# Altium schematic sheet M2.SchDoc
size A
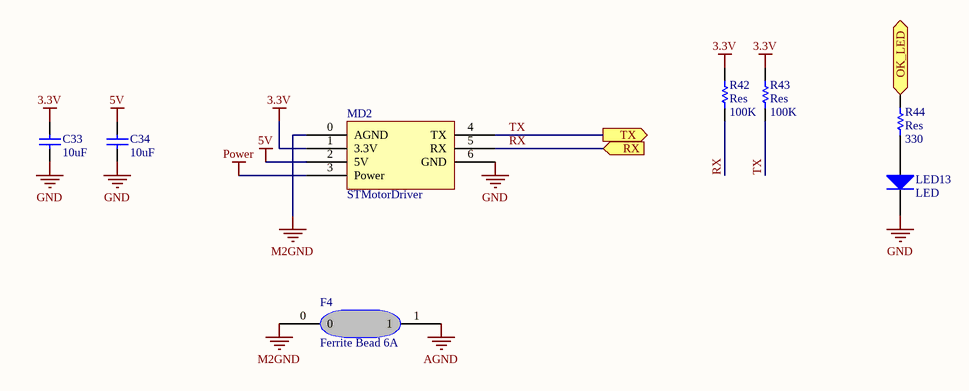
[diagram p0: M2.SchDoc]

## Parts
C33  value 10uF  [2012[0805]]  (hidden comment: Cap_UP)
C34  value 10uF  [2012[0805]]  (hidden comment: Cap_UP)
F4  Ferrite Bead 6A  [f6A]
LED13  LED  [2012[0805]]
MD2  STMotorDriver  [MotorDriver]
R42  Res  value 100K  [2012[0805]]
R43  Res  value 100K  [2012[0805]]
R44  Res  value 330  [2012[0805]]

## Ports
OK_LED (in), RX (in), TX (out)

## Nets
3.3V: C33.2 MD2.1(3.3V) R42.2 R43.2
5V: C34.2 MD2.2(5V)
AGND: F4.1
GND: C33.1 C34.1 LED13.2(K) MD2.6(GND)
M2GND: F4.0 MD2.0(AGND)
Power: MD2.3(Power)
OK_LED: R44.1 ; port OK_LED
RX: MD2.5(RX) R42.1 ; port RX
TX: MD2.4(TX) R43.1 ; port TX
NetLED13_1: LED13.1(A) R44.2

## Library data of the parts
C33 C34 = Cap_UP: Capacitor; Published: 8-Jun-2000; LatestRevisionDate: 17-Jul-2002; LatestRevisionNote: Re-released for DXP Platform.; PackageReference: RAD-0.3; Publisher: Altium Limited
F4 = F6A
LED13 = Diode: 1 Amp General Purpose Rectifier; Revision 1: 11-Jul-2000: SIM Model Added.; Revision 2: 17-Jul-2002: Re-released for DXP Platform.; Package Information: Latest Revision: Aug-1999; Code - JEDEC: DO-204-AL; Published: 8-Jun-2000; Datasheet: Latest Revision: 1998; Package Reference: DO-41; Publisher: Altium Limited
R42-R44 = Res: Semiconductor Resistor; Published: 8-Jun-2000; LatestRevisionDate: 17-Jul-2002; LatestRevisionNote: Re-released for DXP Platform.; PackageReference: AXIAL-0.5; Publisher: Altium Limited